# EAGLE design Button_V1_1 (EAGLE 9.3.1)
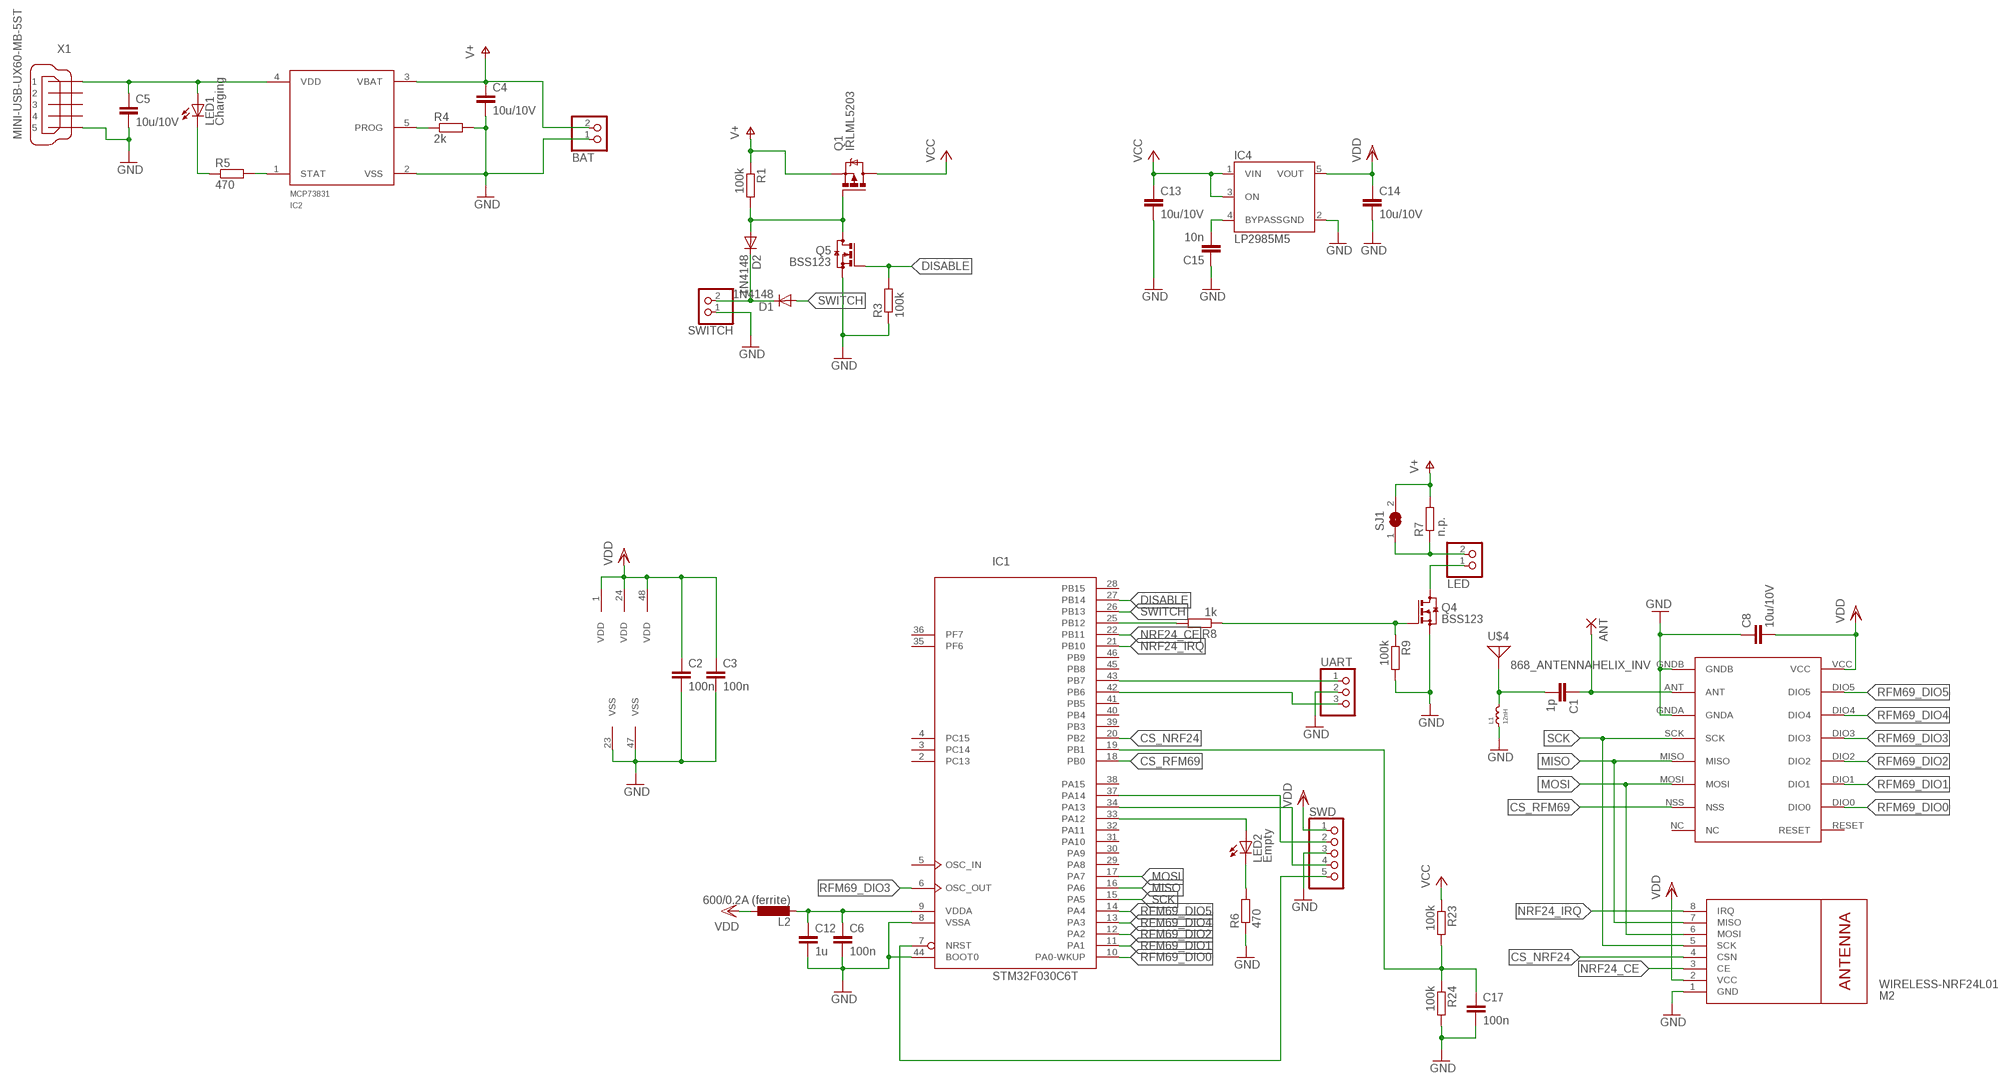
[diagram p0: schematic, sheet 1]

## Parts
ANT  1,6/0,8  [1,6/0,8]
BAT  PINHD-1X2  [1X02]
C1  1p  C-EUC0603  [C0603]
C2  100n  C-EUC0603  [C0603]
C3  100n  C-EUC0603  [C0603]
C4  10u/10V  C-EUC1206  [C1206]
C5  10u/10V  C-EUC1206  [C1206]
C6  100n  C-EUC0603  [C0603]
C8  10u/10V  C-EUC1206  [C1206]
C12  1u  C-EUC0603  [C0603]
C13  10u/10V  C-EUC1206  [C1206]
C14  10u/10V  C-EUC1206  [C1206]
C15  10n  C-EUC0603  [C0603]
C17  100n  C-EUC0603  [C0603]
D1  1N4148  DIODE-SOD323-W  [SOD323-W]
D2  1N4148  DIODE-SOD323-W  [SOD323-W]
IC1  STM32F030C6T  [LQFP48]
IC2  MCP73831  [SOT23-5]
IC4  LP2985M5  [SOT23-5]
L1  12nH  RF-INDUCTOR.0603  [0603]
L2  600/0.2A (ferrite)  L-EUL2012C  [L2012C]
LED  PINHD-1X2  [1X02]
LED1  Charging  LEDCHIPLED_0603  [CHIPLED_0603]
LED2  Empty  LEDCHIPLED_0603  [CHIPLED_0603]
M2  WIRELESS-NRF24L01  [WIRELESS-NRF24L01]
Q1  IRLML5203  [MICRO3]
Q4  BSS123  [SOT23]
Q5  BSS123  [SOT23]
R1  100k  R-EU_R0603  [R0603]
R3  100k  R-EU_R0603  [R0603]
R4  2k  R-EU_R0603  [R0603]
R5  470  R-EU_R0603  [R0603]
R6  470  R-EU_R0603  [R0603]
R7  n.p.  R-EU_R1206  [R1206]
R8  1k  R-EU_R0603  [R0603]
R9  100k  R-EU_R0603  [R0603]
R23  100k  R-EU_R0603  [R0603]
R24  100k  R-EU_R0603  [R0603]
SJ1  SJ  [SJ]
SWD  PINHD-1X5  [1X05]
SWITCH  PINHD-1X2  [1X02]
U$1  RFM69HW  [RFM]
U$4  868_ANTENNAHELIX_INV  [HELIX_868_INV]
UART  PINHD-1X3  [1X03]
X1  MINI-USB-UX60-MB-5ST  [UX60-MB-5ST]

## Nets
_SWITCH: D1.C D2.C SWITCH.2
CS_NRF24: IC1.20(PB2) M2.4(CSN)
CS_RFM69: IC1.18(PB0) U$1.NSS
DISABLE: IC1.27(PB14) Q5.1(G) R3.2
GND: BAT.1 C2.2 C3.2 C4.2 C5.2 C6.2 C8.1 C12.2 C13.2 C14.2 C15.1 C17.2 IC1.8(VSSA) IC1.23(VSS) IC1.44(BOOT0) IC1.47(VSS) IC2.2(VSS) IC4.2(GND) L1.1 M2.1(GND) Q4.2(S) Q5.2(S) R3.1 R4.2 R6.1 R9.2 R24.2 SWD.3 SWITCH.1 U$1.GNDA U$1.GNDB UART.2 X1.5
MISO: IC1.16(PA6) M2.7(MISO) U$1.MISO
MOSI: IC1.17(PA7) M2.6(MOSI) U$1.MOSI
N$1: D2.A Q1.1(G) Q5.3(D) R1.2
N$3: IC2.5(PROG) R4.1
N$4: ANT.1(P) C1.1 U$1.ANT
N$5: C1.2 L1.2 U$4.ANT U$4.P$2 U$4.P$3 U$4.P$4 U$4.P$5 U$4.P$6 U$4.P$7 U$4.P$8 U$4.P$9 U$4.P$10 U$4.P$11 U$4.P$12 U$4.P$13 U$4.P$14 U$4.P$15 U$4.P$16 U$4.P$17 U$4.P$18 U$4.P$19 U$4.P$20
N$7: LED2.C R6.2
N$8: IC2.1(STAT) R5.2
N$9: IC1.33(PA12) LED2.A
N$10: LED1.C R5.1
N$13: LED.1 Q4.3(D)
N$17: LED.2 R7.1 SJ1.1
N$18: Q4.1(G) R8.1 R9.1
N$19: IC1.25(PB12) R8.2
N$30: C15.2 IC4.4(BYPASS)
N$31: C17.1 IC1.19(PB1) R23.2 R24.1
NRF24_CE: IC1.22(PB11) M2.3(CE)
NRF24_IRQ: IC1.21(PB10) M2.8(IRQ)
NRST: IC1.7(NRST) SWD.5
RFM69_DIO0: IC1.10(PA0-WKUP) U$1.DIO0
RFM69_DIO1: IC1.11(PA1) U$1.DIO1
RFM69_DIO2: IC1.12(PA2) U$1.DIO2
RFM69_DIO3: IC1.6(OSC_OUT) U$1.DIO3
RFM69_DIO4: IC1.13(PA3) U$1.DIO4
RFM69_DIO5: IC1.14(PA4) U$1.DIO5
RX: IC1.43(PB7) UART.1
SCK: IC1.15(PA5) M2.5(SCK) U$1.SCK
SWCLK: IC1.37(PA14) SWD.2
SWDIO: IC1.34(PA13) SWD.4
SWITCH: D1.A IC1.26(PB13)
TX: IC1.42(PB6) UART.3
V+: BAT.2 C4.1 IC2.3(VBAT) Q1.2(S) R1.1 R7.2 SJ1.2
VCC: C13.1 IC4.1(VIN) IC4.3(ON) Q1.3(D) R23.1
VDD: C2.1 C3.1 C8.2 C14.1 IC1.1(VDD) IC1.24(VDD) IC1.48(VDD) IC4.5(VOUT) L2.1 M2.2(VCC) SWD.1 U$1.VCC
VDDA: C6.1 C12.1 IC1.9(VDDA) L2.2
VIN: C5.1 IC2.4(VDD) LED1.A X1.1
Unconnected: IC1.2(PC13) IC1.3(PC14) IC1.4(PC15) IC1.5(OSC_IN) IC1.28(PB15) IC1.29(PA8) IC1.30(PA9) IC1.31(PA10) IC1.32(PA11) IC1.35(PF6) IC1.36(PF7) IC1.38(PA15) IC1.39(PB3) IC1.40(PB4) IC1.41(PB5) IC1.45(PB8) IC1.46(PB9) U$1.NC U$1.RESET X1.2 X1.3 X1.4

## Library data of the parts
ANT = wirepad:1,6/0,8: THROUGH-HOLE PAD
BAT LED SWITCH = pinhead:PINHD-1X2: PIN HEADER
C1-C6 C8 C12-C15 C17 = rcl:C-EU: CAPACITOR, European symbol
D1 D2 = diode:DIODE-: DIODE
IC1 = micro-stm_v3:STM32F030C*T: ARM 32-bit Cortex™-M0 CPU 48 MHz maximum frequency 32 to 64 Kbytes of Flash memory 4 to 8 kbytes of SRAM 39 GPIOs 2.4 to 3.6 V application supply
IC2 = mcp:MCP73831
IC4 = v-reg-3:LP2985: National Semiconductor <http://www.national.com> Micropower Linear Regulator 150mA regulated output, Vin 16V max., ultra-low dropout of 300mV @ 150mA, 1µA standby current, low noise
L1 = standardparts:RF-INDUCTOR
L2 = rcl:L-EU: INDUCTOR, European symbol
LED1 LED2 = led:LED: LED OSRAM: - CHIPLED LG R971, LG N971, LY N971, LG Q971, LY Q971, LO R971, LY R971 LH N974, LH R974 LS Q976, LO Q976, LY Q976 LO Q996 - Hyper CHIPLED LW Q18S LB Q993, LB Q99A, LB R99A - SideLED LS A670, LO A670, LY A670, LG A670, LP A670 LB A673, LV A673, LT A673, LW A673 LH A674 LY A675 LS A676, LA A676, LO A676, LY A676, LW A676 LS A679, LY A679, LG A679 - Hyper Micro SIDELED® LS Y876, LA Y876, LO Y876, LY Y876 LT Y87S - SmartLED LW L88C, LW L88S LB L89C, LB L89S, LG L890 LS L89K, LO L89K, LY L89K LS L896, LA L896, LO L896, LY L896 - TOPLED LS T670, LO T670, LY T670, LG T670, LP T670 LSG T670, LSP T670, LSY T670, LOP T670, LYG T670 LG T671, LOG T671, LSG T671 LB T673, LV T673, LT T673, LW T673 LH T674 LS T676, LA T676, LO T676, LY T676, LB T676, LH T676, LSB T676, LW T676 LB T67C, LV T67C, LT T67C, LS T67K, LO T67K, LY T67K, LW E67C LS E67B, LA E67B, LO E67B, LY E67B, LB E67C, LV E67C, LT E67C LW T67C LS T679, LY T679, LG T679 LS T770, LO T770, LY T770, LG T770, LP T770 LB T773, LV T773, LT T773, LW T773 LH T774 LS E675, LA E675, LY E675, LS T675 LS T776, LA T776, LO T776, LY T776, LB T776 LHGB T686 LT T68C, LB T68C - Hyper Mini TOPLED® LB M676 - Mini TOPLED Santana® LG M470 LS M47K, LO M47K, LY M47K Source: http://www.osram.convergy.de LUXEON: - LUMILED® LXK2-PW12-R00, LXK2-PW12-S00, LXK2-PW14-U00, LXK2-PW14-V00 LXK2-PM12-R00, LXK2-PM12-S00, LXK2-PM14-U00 LXK2-PE12-Q00, LXK2-PE12-R00, LXK2-PE12-S00, LXK2-PE14-T00, LXK2-PE14-U00 LXK2-PB12-K00, LXK2-PB12-L00, LXK2-PB12-M00, LXK2-PB14-N00, LXK2-PB14-P00, LXK2-PB14-Q00 LXK2-PR12-L00, LXK2-PR12-M00, LXK2-PR14-Q00, LXK2-PR14-R00 LXK2-PD12-Q00, LXK2-PD12-R00, LXK2-PD12-S00 LXK2-PH12-R00, LXK2-PH12-S00 LXK2-PL12-P00, LXK2-PL12-Q00, LXK2-PL12-R00 Source: www.luxeon.com KINGBRIGHT: KA-3528ASYC Source: www.kingbright.com
M2 = diy-modules:WIRELESS-NRF24L01: 2.4 GHz Wireless Module based on NRF24L01 chip More details available here: http://www.electrodragon.com/w/NRF24L01 Click here to find device on ebay.com <http://www.ebay.com/sch/nrf24l01+arduino>
Q1 = transistor-power:IRLML5203: HEXFET P-Channel Power MOSFET
Q4 Q5 = transistor-small-signal:BSS123: N-CHANNEL MOS FET
R1 R3-R9 R23 R24 = rcl:R-EU_: RESISTOR, European symbol
SJ1 = jumper:SJ: SMD solder JUMPER
SWD = pinhead:PINHD-1X5: PIN HEADER
U$1 = hoperf:RFM69HW
U$4 = antenna:868_ANTENNA
UART = pinhead:PINHD-1X3: PIN HEADER
X1 = con-hirose:MINI-USB-: MINI USB Connector Source: http://www.hirose.co.jp/cataloge_hp/e24000019.pdf; OC_FARNELL: unknown; OC_NEWARK: unknown

## Board
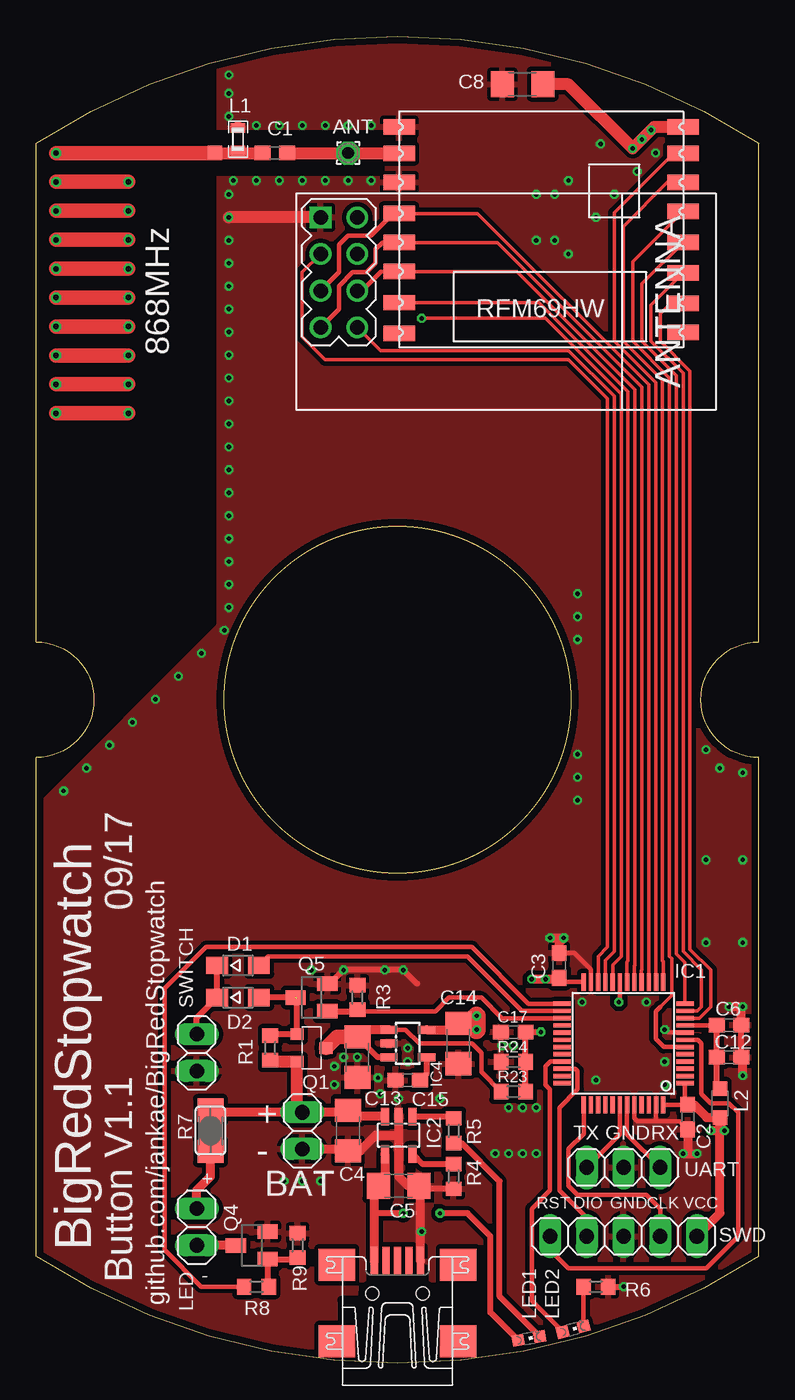
[diagram p1: board, top side]
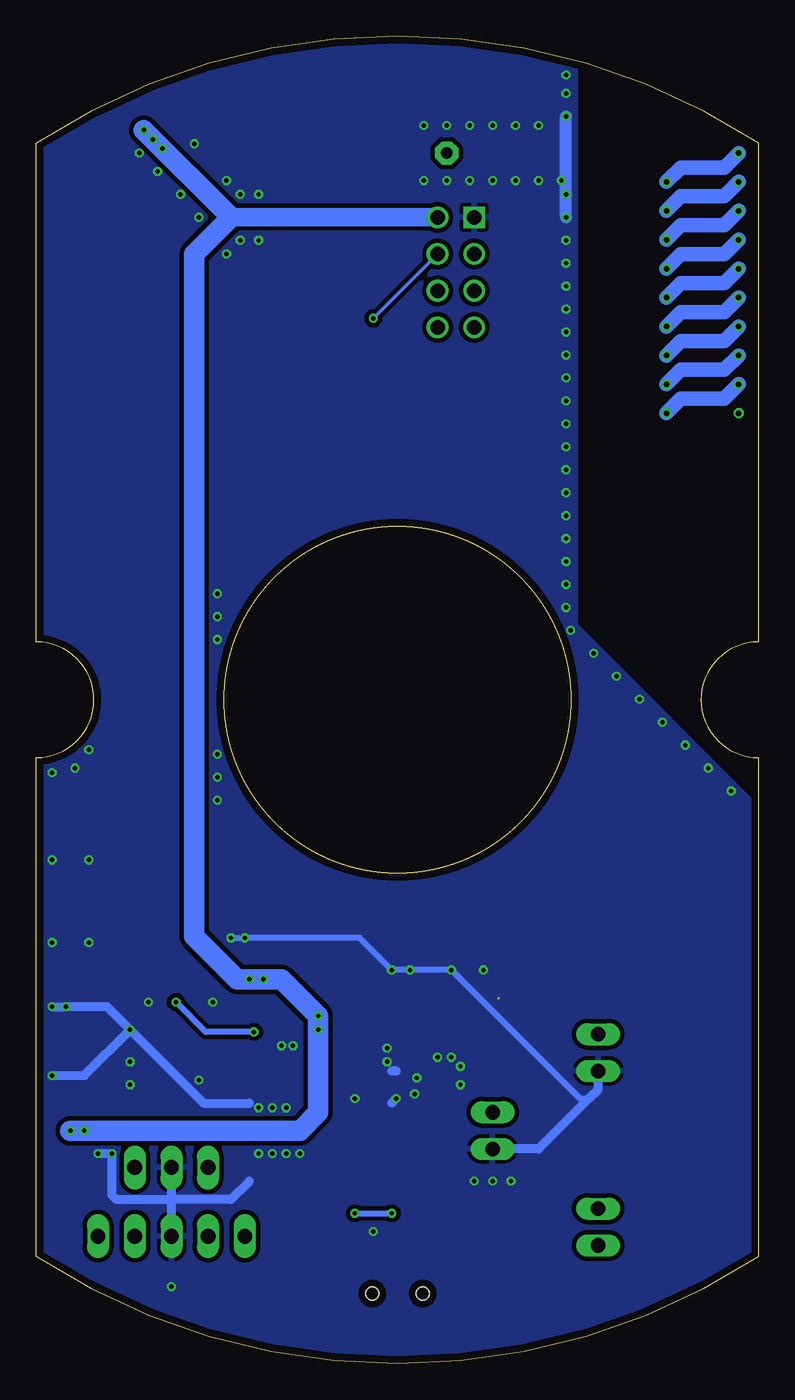
[diagram p2: board, bottom side, seen from below]

Size 50 x 91.81 mm. Coordinates in mm from the lower left corner, seen from the top.
Outline: 0,7.4 0,41.9 arc180 0,49.9 0,84.4 arc-66 50,84.4 50,49.9 arc180 50,41.9 50,7.4 arc-66 0,7.4
Outline: circle at 25,45.9 radius 12
Copper layers (1*16): Top 0.035mm / dielectric 1.6mm / Bottom 0.035mm
Design rules "Elecrow_2-layer_PCB_eagle_rule *": minimum track width 6mil, minimum drill 0.3mm, track to track 6mil, track to pad 6mil, pad to pad 6mil, via to via 8mil, smd to smd 0mil, copper to edge 20mil, drill to drill 10mil, minimum pad ring 6mil, minimum via ring 6mil, stop-mask expansion 0mil, vias tented up to drill 100mil, thermal gap 10mil
tKeepout: area 8,28.9 to 42,62.9
tRestrict: area 12.4,82.5 to 23.8,85

### Footprints (pad centres in the part's own frame; a part is rotated, then mirrored left to right if it is on the bottom)
1,6/0,8 = drill 0.813 pad 1.6 octagon: 1 0,0
1X02 = drill 1.016 long: 1 -1.27,0; 2 1.27,0
C0603 = smd 1.1 x 1: 1 -0.85,0; 2 0.85,0
C1206 = smd 1.6 x 1.8: 1 -1.4,0; 2 1.4,0
SOD323-W = smd 1.5 x 1.2: A 1.45,0; C -1.45,0
LQFP48 = smd 0.3 x 1.2: 1 -2.75,-4.25; 2 -2.25,-4.25; 3 -1.75,-4.25; 4 -1.25,-4.25; 5 -0.75,-4.25; 6 -0.25,-4.25; 7 0.25,-4.25; 8 0.75,-4.25; 9 1.25,-4.25; 10 1.75,-4.25; 11 2.25,-4.25; 12 2.75,-4.25; 25 2.75,4.25; 26 2.25,4.25; 27 1.75,4.25; 28 1.25,4.25; 29 0.75,4.25; 30 0.25,4.25; 31 -0.25,4.25; 32 -0.75,4.25; 33 -1.25,4.25; 34 -1.75,4.25; 35 -2.25,4.25; 36 -2.75,4.25 | smd 1.2 x 0.3: 13 4.25,-2.75; 14 4.25,-2.25; 15 4.25,-1.75; 16 4.25,-1.25; 17 4.25,-0.75; 18 4.25,-0.25; 19 4.25,0.25; 20 4.25,0.75; 21 4.25,1.25; 22 4.25,1.75; 23 4.25,2.25; 24 4.25,2.75; 37 -4.25,2.75; 38 -4.25,2.25; 39 -4.25,1.75; 40 -4.25,1.25; 41 -4.25,0.75; 42 -4.25,0.25; 43 -4.25,-0.25; 44 -4.25,-0.75; 45 -4.25,-1.25; 46 -4.25,-1.75; 47 -4.25,-2.25; 48 -4.25,-2.75
SOT23-5 = smd 0.55 x 1.2: 1 -0.95,-1.3; 2 0,-1.3; 3 0.95,-1.3; 4 0.95,1.3; 5 -0.95,1.3
0603 = smd 0.65 x 1: 1 -0.775,0; 2 0.775,0
L2012C = smd 1 x 1: 1 -1,0; 2 1,0
CHIPLED_0603 = smd 0.8 x 0.8: A 0,-0.75; C 0,0.75
WIRELESS-NRF24L01 = drill 1 square: 1 -12.7,6.35 | drill 1: 2 -10.16,6.35; 3 -12.7,3.81; 4 -10.16,3.81; 5 -12.7,1.27; 6 -10.16,1.27; 7 -12.7,-1.27; 8 -10.16,-1.27
MICRO3 = smd 0.8 x 0.9: 1 -0.95,-1; 2 0.95,-1; 3 0,1
SOT23 = smd 1 x 1.4: 1 -0.95,-1.1; 2 0.95,-1.1; 3 0,1.1
R0603 = smd 1 x 1.1: 1 -0.85,0; 2 0.85,0
R1206 = smd 1.6 x 1.803: 1 -1.422,0; 2 1.422,0
SJ = smd 1.168 x 1.6: 1 -0.762,0; 2 0.762,0
1X05 = drill 1.016 long: 1 -5.08,0; 2 -2.54,0; 3 0,0; 4 2.54,0; 5 5.08,0
RFM = smd 2.184 x 1.067: ANT 19.651,2.889; DIO0 0,13.27; DIO1 0,11.143; DIO2 0,9.047; DIO3 0,6.889; DIO4 0,4.889; DIO5 0,2.889; GNDA 19.651,4.889; GNDB 19.651,1.048; MISO 19.651,9.047; MOSI 19.651,11.047; NC 19.651,15.334; NSS 19.651,13.206; RESET 0,15.27; SCK 19.651,7.048; VCC 0,1.048
HELIX_868_INV = smd 1 x 1: ANT 0,0 | drill 0.38 octagon: P$2 0,11; P$3 -2,11; P$4 -4,11; P$5 -6,11; P$6 -8,11; P$7 -10,11; P$8 -12,11; P$9 -14,11; P$10 -16,11; P$11 -18,11; P$12 -18,6; P$13 -16,6; P$14 -14,6; P$15 -12,6; P$16 -10,6; P$17 -8,6; P$18 -6,6; P$19 -4,6; P$20 -2,6
1X03 = drill 1.016 long: 1 -2.54,0; 2 0,0; 3 2.54,0
UX60-MB-5ST = smd 2 x 0.5: 1 2.25,1.6; 2 2.25,0.8; 3 2.25,0; 4 2.25,-0.8; 5 2.25,-1.6 | smd 2.2 x 2.5: M1 -3.3,-4.2; M2 -3.3,4.2; M3 2,4.2; M4 2,-4.2 | hole 0.9: 0,-1.75; 0,1.75

### Placement (x,y rotation side)
ANT  21.59,83.72 0 top
BAT  18.41,16.1 90 top
C1  16.51,83.72 180 top
C2  45.09,17.05 270 top
C3  36.2,27.53 90 top
C4  21.59,16.1 270 top
C5  25.08,12.29 0 top
C6  47.94,23.4 0 top
C8  33.66,88.49 0 top
C12  47.94,21.18 0 top
C13  22.23,21.18 270 top
C14  29.21,22.13 270 top
C15  25.72,19.59 0 top
C17  33.02,22.92 180 top
D1  13.97,27.53 0 top
D2  13.97,25.3 0 top
IC1  40.64,22.13 90 top
IC2  25.08,15.78 180 top
IC4  25.72,22.13 270 top
L1  13.97,84.68 270 top
L2  47.31,18 90 top
LED  11.11,9.43 90 top
LED1  34.1,1.73 280 top
LED2  37.16,2.36 285 top
M2  32.38,72.93 0 top
Q1  19.05,21.81 270 top
Q4  14.92,8.16 90 top
Q5  19.05,25.3 90 top
R1  16.19,21.81 90 top
R3  22.23,25.3 270 top
R4  28.89,12.92 270 top
R5  28.89,16.1 90 top
R6  38.73,5.3 180 top
R7  12.06,16.1 90 top
R8  15.24,5.3 180 top
R9  18.1,8.16 90 top
R23  33.02,18.8 0 top
R24  33.02,20.86 180 top
SJ1  12.06,16.1 90 top
SWD  40.64,8.79 180 top
SWITCH  11.11,21.49 90 top
U$1  44.77,86.58 180 top
U$4  12.38,83.72 90 top
UART  40.64,13.56 180 top
X1  25,4.83 90 top

### Tracks (layer width: path | path; a pad name or v marks a point on that pad's centre or on a via)
_SWITCH
  Top 0.406: SWITCH.2 11.11,23.9 D2.C D1.C
CS_NRF24  (via drill 0.3)
  Top 0.254: v26.67,72.29 35.24,72.29 40.48,67.06 40.48,28.16 39.89,27.57 IC1.20
  Bottom 0.254: M2.4 v26.67,72.29
CS_RFM69
  Top 0.254: U$1.NSS 34.8,73.38 40.96,67.21 40.96,27.84 40.89,27.78 IC1.18
DISABLE
  Top 0.305: IC1.27 32.22,23.88 30.8,25.3 28.57,25.3 27.62,24.35 22.33,24.35 R3.2
  Top 0.406: Q5.1 20.32,24.35 22.12,24.35 R3.2
GND  (via drill 0.3)
  Top 0.305: IC1.23 38.39,27.24 37.25,28.38 C3.2 | IC1.44 41.39,16.93 41.59,16.73 42.86,16.73 | 42.86,16.73 44.55,16.73 C2.2 | IC1.47 42.89,16.76 42.86,16.73 | IC1.8 43.7,22.88 v43.5,23.08
  Top 0.406: R4.2 26.7,12.07 C5.2 | C12.2 C6.2 | 26.36,26.25 v25.4,27.21 v21.27,27.21 20.32,26.25 | R6.1 v40.64,5.3
  Top 0.61: 13.97,85.63 L1.1 | X1.5 26.6,12.17 C5.2 25.72,12.29 25.08,12.92 25.08,15.78 | IC2.2 25.08,15.78 | 25.08,15.78 23.5,15.78 22.41,14.7 C4.2 21.46,14.83 BAT.1 | v35.56,29.43 v36.51,29.43 36.2,29.11 C3.2 | v44.77,14.51 45.09,14.51 | 45.09,14.51 v45.72,14.51 | v47.94,24.67 v48.9,24.67 48.79,24.57 C6.2 | v48.9,19.91 48.9,21.18 | C2.2 45.09,14.51
  Top 0.813: M2.1 v13.34,79.28
  Bottom 0.406: v36.51,29.43 v35.56,29.43 27.62,29.43 v25.4,27.21 v21.27,27.21 12.38,18.32 11.75,18.32
  Bottom 0.61: v25.08,18.32 25.4,18 | SWD.3 40.64,11.33 | 40.64,11.33 UART.2 | v45.72,14.51 v44.77,14.51 44.77,11.65 44.45,11.33 40.64,11.33 | 35.24,12.6 36.51,11.33 40.64,11.33 | 25.08,20.22 25.4,20.22 | BAT.1 15.24,14.83 11.75,18.32 11.11,18.95 SWITCH.1 | v48.9,19.91 46.67,19.91 v43.5,23.08 | v48.9,24.67 v47.94,24.67 45.09,24.67 v43.5,23.08 | v43.5,23.08 38.42,18 35.24,18
  Bottom 0.813: v13.34,79.28 v13.34,86.26
  other vias: 13.34,80.87 13.34,87.85 13.34,89.12 13.34,77.69 13.34,76.1 13.34,74.52 13.34,72.93 13.34,71.34 13.34,69.75 13.34,68.17 13.34,66.58 13.34,64.99 13.34,63.4 13.34,61.82 13.34,60.23 13.34,58.64 34.61,17.68 25.72,21.81 27.94,18.32 33.66,17.68 15.24,85.63 16.83,85.63 18.41,85.63 20,85.63 20,81.82 18.41,81.82 16.83,81.82 15.24,81.82 13.34,57.05 13.34,55.47 13.34,53.88 13.34,52.29 13.02,50.7 11.43,49.12 9.84,47.53 8.26,45.94 6.67,44.35 5.08,42.77 3.49,41.18 1.91,39.59 21.59,85.63 23.18,85.63 21.59,81.82 23.18,81.82 13.65,81.82 38.73,79.28 35.88,77.69 35.88,80.87 36.83,81.82 34.61,80.87 34.61,77.69 36.83,76.74 42.86,83.72 41.59,82.45 40.01,80.87 39.05,84.36 48.9,40.86 46.35,42.45 47.31,41.18 46.35,29.11 48.9,29.11 48.9,34.83 46.35,34.83 26.67,9.11 18.41,12.6 19.68,12.6 17.14,12.6 37.47,42.13 37.47,40.54 37.47,38.96 37.47,50.07 37.47,51.66 37.47,53.24 38.73,19.59 43.5,19.27 43.5,20.86 42.23,24.99 37.78,24.99 19.05,27.21 24.13,27.21 25.72,20.86 21.27,21.18 22.23,21.18 20.64,20.54 20.64,19.27 23.81,18.64 23.65,19.75 32.23,21.97 33.02,21.97 32.7,17.68 34.61,14.51 33.66,14.51 32.7,14.51 31.75,14.51
  pour Bottom (isolate 0.305): 12.7,92.93 50.8,92.93 50.8,-0.73 -0.32,-0.73 -0.32,38 12.7,51.02
  pour Top (isolate 0.305): 12.7,92.93 50.8,92.93 50.8,-0.73 -0.32,-0.73 -0.32,38 12.7,51.02
MISO
  Top 0.254: 23.97,77.53 U$1.MISO 31.91,77.53 41.91,67.53 41.91,27.21 41.89,27.19 IC1.16
  Top 0.305: M2.7 20.95,72.93 20.95,74.52 21.91,75.47 22.86,75.47 23.5,76.1 23.5,77.06 23.97,77.53
MOSI
  Top 0.254: 23.88,75.53 U$1.MOSI 33.27,75.53 41.43,67.37 41.43,27.53 41.39,27.48 IC1.17
  Top 0.305: M2.6 22.54,74.2 23.88,75.53
N$1  (1 unrouted)
  Top 0.406: R1.2 16.29,22.76 Q1.1 18.05,25.2 | Q5.3 D2.A
N$3
  Top 0.406: R4.1 26.74,13.77 IC2.5
N$4
  Top 0.813: C1.1 ANT.1 25.12,83.72 U$1.ANT
N$5
  Top 0.61: L1.2 13.65,83.9 13.65,83.72
  Top 0.813: U$4.ANT 13.65,83.72 C1.2
N$7
  Top 0.305: R6.2 LED2.C
N$8
  Top 0.406: IC2.1 28.76,17.08 R5.2
N$9
  Top 0.305: LED2.A 34.29,4.31 34.29,10.7 35.56,11.97 35.56,18.95 35.24,19.27 35.24,20.54 35.58,20.88 IC1.33
N$10
  Top 0.406: LED1.C 32.07,4.63 32.07,12.6 29.43,15.25 R5.1
N$13
  Top 0.61: Q4.3 LED.1
N$17
  Top 0.61: LED.2 11.11,11.97 12.06,12.92 R7.1
  Top 0.813: R7.1 SJ1.1
N$18
  Top 0.406: R9.1 18,7.21 Q4.1 16.02,5.37 R8.1
N$19
  Top 0.305: R8.2 11.43,5.3 8.89,7.84 8.89,25.94 11.75,28.8 30.16,28.8 34.08,24.88 IC1.25
N$30
  Top 0.406: IC4.4 27.02,20.04 C15.2
N$31  (via drill 0.3)
  Top 0.305: v40.32,24.99 40.39,25.05 IC1.19
  Top 0.406: R23.2 R24.1 C17.1 v34.92,22.92
  Bottom 0.406: v34.92,22.92 38.26,22.92 v40.32,24.99
NRF24_CE
  Top 0.254: M2.3 18.41,75.47 18.41,71.02 20,69.44 36.83,69.44 39.53,66.74 39.53,28.8 38.89,28.16 IC1.22
NRF24_IRQ
  Top 0.254: M2.8 23.81,70.07 36.83,70.07 40.01,66.9 40.01,28.48 39.39,27.86 IC1.21
NRST
  Top 0.305: SWD.5 35.56,7.84 36.83,6.57 46.35,6.57 48.58,8.79 48.58,17.37 47.94,18 46.67,18 46.04,18.64 46.04,22.13 45.79,22.38 IC1.7
RFM69_DIO0
  Top 0.254: U$1.DIO0 43.88,73.31 43.18,72.61 43.18,70.71 45.24,68.64 45.24,28.64 46.67,27.21 46.67,24.67 45.88,23.88 IC1.10
RFM69_DIO1
  Top 0.254: U$1.DIO1 42.55,73.22 42.55,70.71 44.77,68.48 44.77,28.48 46.04,27.21 46.04,24.67 45.75,24.38 IC1.11
RFM69_DIO2
  Top 0.254: U$1.DIO2 41.91,74.68 41.91,70.71 44.29,68.33 44.29,28.32 44.89,27.72 IC1.12
RFM69_DIO3
  Top 0.254: U$1.DIO3 41.27,76.2 41.27,70.71 43.81,68.17 43.81,28.16 43.97,28 43.97,25.46 43.18,24.67
  Top 0.305: IC1.6 43.43,21.88 42.86,22.45 42.86,24.35 43.18,24.67
RFM69_DIO4
  Top 0.254: U$1.DIO4 43.69,81.69 40.64,78.64 40.64,70.71 43.34,68.01 43.34,27.84 43.39,27.79 IC1.13
RFM69_DIO5
  Top 0.254: U$1.DIO5 44.1,83.69 40.01,79.6 40.01,70.71 42.86,67.85 42.86,27.53 42.89,27.5 IC1.14
RX
  Top 0.305: UART.1 40.89,15.85 IC1.43
SCK
  Top 0.254: 24.7,79.53 U$1.SCK 30.54,79.53 42.39,67.69 42.39,27.21 IC1.15
  Top 0.305: M2.5 20.95,75.47 20.95,77.37 21.59,78.01 23.18,78.01 24.7,79.53
SWCLK
  Top 0.305: SWD.2 43.18,10.7 42.23,11.65 37.47,11.65 36.83,12.29 36.83,14.83 37.89,15.89 IC1.37
SWDIO
  Top 0.305: SWD.4 38.1,10.06 36.2,11.97 36.2,17.68 37.47,18.95 37.47,20.22 37.31,20.38 IC1.34
SWITCH
  Top 0.305: IC1.26 33.63,24.38 29.84,28.16 16.05,28.16 D1.A
TX
  Top 0.305: UART.3 40.39,15.85 IC1.42
V+
  Top 0.61: IC2.3 22.01,17.08 C4.1 21.46,17.37 BAT.2 12.22,17.37 R7.2 | R1.1 16.19,20.86
  Top 0.813: SJ1.2 R7.2 | BAT.2 18.05,17.73 Q1.2 16.29,20.86 R1.1
VCC
  Top 0.305: R23.1 30.8,20.17 30.8,21.49 30.16,22.13 26.51,22.13 25.56,23.08 IC4.1
  Top 0.406: IC4.3 23.62,21.18 C13.1
  Top 0.61: IC4.1 22.73,23.08 C13.1
  Top 1.016: Q1.3 20.82,22.58 C13.1
VDD  (via drill 0.3)
  Top 0.305: IC1.1 44.89,18.09 C2.1 45.06,17.88 IC1.48 | IC1.24 36.49,26.38 C3.1 36.09,26.57
  Top 0.406: C14.1 30.03,23.53 v30.48,23.08
  Top 0.61: SWD.1 47.31,10.38 L2.1 | 47.26,17 L2.1 | 36.09,26.57 v34.29,26.57 | v46.67,16.1 v47.62,16.1 47.31,16.41 L2.1 | 47.26,17 46.4,17 45.51,17.9 C2.1 | 47.26,17 47.31,17.05 L2.1 | 29.34,23.08 C14.1 28.76,23.08 IC4.5
  Top 0.813: U$1.VCC 42.77,85.53 v42.55,85.31 v41.91,84.68 v41.27,84.04 36.9,88.41 arc45 36.73,88.49 C8.2
  Top 1.27: v30.48,24.03 v30.48,23.08
  Bottom 1.016: v34.29,26.57 v35.24,26.57
  Bottom 1.27: M2.2 36.51,79.28
  Bottom 1.422: v42.55,85.31 36.51,79.28 39.05,76.74 39.05,29.53 36.09,26.57 v34.29,26.57 33.02,26.57 v30.48,24.03 v30.48,23.08 30.48,17.37 31.75,16.1 v46.67,16.1 v47.62,16.1
VDDA
  Top 0.305: IC1.9 47.07,23.38 C6.1
  Top 0.406: L2.2 47.09,19.22 C12.1 C6.1
VIN  (via drill 0.3)
  Top 0.406: LED1.A 31.43,3.53 31.43,8.79 29.84,10.38 v27.94,10.38 | v25.4,10.38 23.4,10.38
  Top 0.61: X1.1 23.4,10.38 23.4,12 C5.1 24.13,12.74 IC2.4
  Bottom 0.406: v27.94,10.38 v25.4,10.38

### Text on the board
tPlace: 868MHz | 09/17 | + | TX | GND | RX | - | + | RST | DIO | GND | CLK | VCC | BigRedStopwatch | Button V1.1 | - | github.com/jankae/BigRedStopwatch